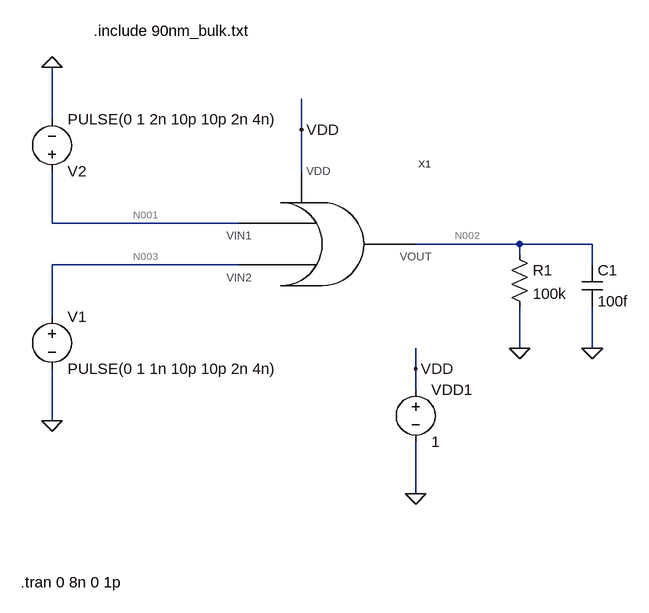
[diagram p0: schematic OR_tb.asc]
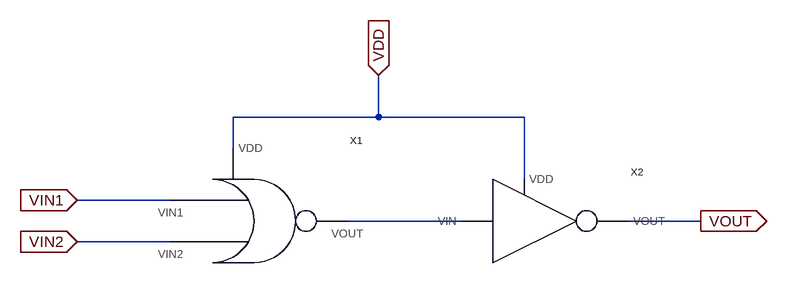
[diagram p1: sub-circuit or.asc]
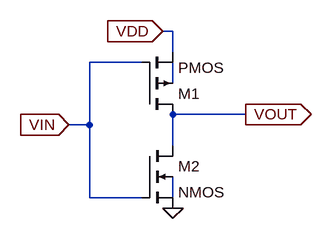
[diagram p2: sub-circuit not.asc]
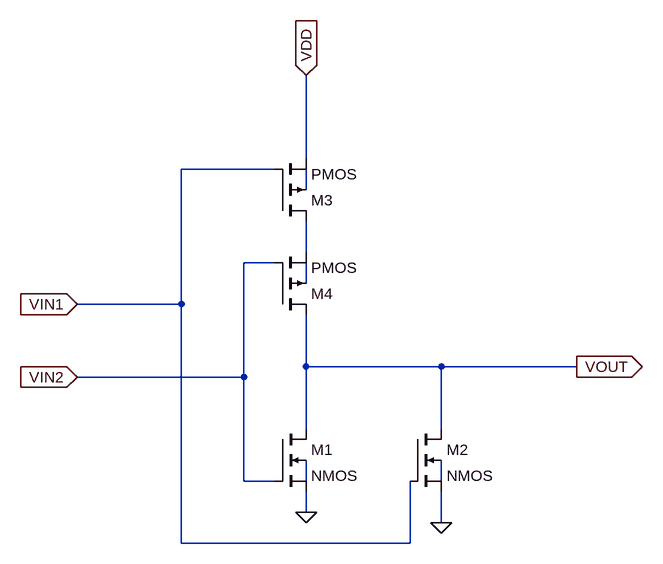
[diagram p3: sub-circuit nor.asc]
OR_tb.asc, the LTspice schematic file:
Version 4
SHEET 1 880 680
WIRE -416 -272 -416 -352
WIRE -32 -256 -32 -304
WIRE -32 -192 -32 -256
WIRE -416 -112 -416 -192
WIRE -128 -112 -416 -112
WIRE 304 -80 144 -80
WIRE 416 -80 304 -80
WIRE 304 -64 304 -80
WIRE -128 -48 -416 -48
WIRE 416 -48 416 -80
WIRE -416 32 -416 -48
WIRE 304 80 304 16
WIRE 416 80 416 16
WIRE 144 112 144 80
WIRE 144 144 144 112
WIRE -416 192 -416 112
WIRE 144 304 144 224
FLAG 144 304 0
FLAG 144 112 VDD
FLAG 304 80 0
FLAG 416 80 0
FLAG -32 -256 VDD
FLAG -416 192 0
FLAG -416 -352 0
SYMBOL voltage -416 16 R0
WINDOW 123 0 0 Left 0
WINDOW 39 0 0 Left 0
SYMATTR InstName V1
SYMATTR Value PULSE(0 1 1n 10p 10p 2n 4n)
SYMBOL res 288 -80 R0
SYMATTR InstName R1
SYMATTR Value 100k
SYMBOL cap 400 -48 R0
SYMATTR InstName C1
SYMATTR Value 100f
SYMBOL voltage 144 128 R0
WINDOW 123 0 0 Left 0
WINDOW 39 0 0 Left 0
SYMATTR InstName VDD1
SYMATTR Value 1
SYMBOL voltage -416 -176 M180
WINDOW 123 0 0 Left 0
WINDOW 39 0 0 Left 0
SYMATTR InstName V2
SYMATTR Value PULSE(0 1 2n 10p 10p 2n 4n)
SYMBOL OR -16 -80 R0
SYMATTR InstName X1
TEXT -352 -408 Left 2 !.include 90nm_bulk.txt
TEXT -464 440 Left 2 !.tran 0 8n 0 1p

or.asc, the sub-circuit schematic file:
Version 4
SHEET 1 972 680
WIRE 352 32 352 -32
WIRE 352 32 128 32
WIRE 576 32 352 32
WIRE 128 80 128 32
WIRE 576 128 576 32
WIRE 32 160 -112 160
WIRE 480 192 304 192
WIRE 848 192 736 192
WIRE 32 224 -112 224
FLAG -112 160 VIN1
IOPIN -112 160 In
FLAG -112 224 VIN2
IOPIN -112 224 In
FLAG 352 -32 VDD
IOPIN 352 -32 In
FLAG 848 192 VOUT
IOPIN 848 192 Out
SYMBOL NOT 576 192 R0
SYMATTR InstName X2
SYMBOL NOR 144 192 R0
SYMATTR InstName X1

not.asc, the sub-circuit schematic file:
Version 4
SHEET 1 880 680
WIRE 208 16 192 16
WIRE 208 48 208 16
WIRE 160 64 80 64
WIRE 208 96 208 64
WIRE 320 144 208 144
WIRE 80 160 80 64
WIRE 80 160 48 160
WIRE 208 192 208 144
WIRE 80 272 80 160
WIRE 160 272 80 272
WIRE 208 272 208 240
FLAG 48 160 VIN
IOPIN 48 160 In
FLAG 320 144 VOUT
IOPIN 320 144 Out
FLAG 192 16 VDD
IOPIN 192 16 In
FLAG 208 288 0
SYMBOL pmos4 160 144 M180
SYMATTR InstName M1
SYMATTR Value2 l=90n w=400n
SYMBOL nmos4 160 192 R0
SYMATTR InstName M2
SYMATTR Value2 l=90n w=200n

nor.asc, the sub-circuit schematic file:
Version 4
SHEET 1 992 680
WIRE 352 -64 352 -192
WIRE 304 -48 160 -48
WIRE 352 -16 352 -48
WIRE 352 80 352 32
WIRE 304 96 256 96
WIRE 352 128 352 96
WIRE 160 160 160 -48
WIRE 160 160 0 160
WIRE 352 256 352 176
WIRE 560 256 352 256
WIRE 768 256 560 256
WIRE 256 272 256 96
WIRE 256 272 0 272
WIRE 352 352 352 256
WIRE 560 352 560 256
WIRE 256 432 256 272
WIRE 304 432 256 432
WIRE 352 432 352 400
WIRE 560 432 560 400
WIRE 352 480 352 448
WIRE 560 496 560 448
WIRE 160 528 160 160
WIRE 512 528 512 432
WIRE 512 528 160 528
FLAG 352 480 0
FLAG 560 496 0
FLAG 0 160 VIN1
IOPIN 0 160 In
FLAG 0 272 VIN2
IOPIN 0 272 In
FLAG 352 -192 VDD
IOPIN 352 -192 In
FLAG 768 256 VOUT
IOPIN 768 256 Out
SYMBOL nmos4 304 352 R0
SYMATTR InstName M1
SYMATTR Value2 l=90n w=200n
SYMBOL nmos4 512 352 R0
SYMATTR InstName M2
SYMATTR Value2 l=90n w=200n
SYMBOL pmos4 304 32 M180
SYMATTR InstName M3
SYMATTR Value2 l=90n w=400n
SYMBOL pmos4 304 176 M180
SYMATTR InstName M4
SYMATTR Value2 l=90n w=400n

The netlist it stands for:
* OR_tb.asc
V1 N003 0 PULSE(0 1 1n 10p 10p 2n 4n)
R1 N002 0 100k
C1 N002 0 100f
VDD1 VDD 0 1
V2 N001 0 PULSE(0 1 2n 10p 10p 2n 4n)
XX1 VDD N001 N002 N003 or

* block symbol definitions
.subckt or VDD VIN1 VOUT VIN2
XX2 N001 VOUT VDD not
XX1 VDD VIN1 N001 VIN2 nor
.ends or

.subckt not VIN VOUT VDD
M1 VOUT VIN VDD N001 PMOS l=90n w=400n
M2 VOUT VIN 0 N002 NMOS l=90n w=200n
.ends not

.subckt nor VDD VIN1 VOUT VIN2
M1 VOUT VIN2 0 N004 NMOS l=90n w=200n
M2 VOUT VIN1 0 N005 NMOS l=90n w=200n
M3 N002 VIN1 VDD N001 PMOS l=90n w=400n
M4 VOUT VIN2 N002 N003 PMOS l=90n w=400n
.ends nor

.model NMOS NMOS
.model PMOS PMOS
.lib standard.mos
.include 90nm_bulk.txt
.tran 0 8n 0 1p
.backanno
.end

* Results of the author's LTspice run, read from the files saved beside the schematic
* Operating Point, zero values left out:
*   V(n002) = 56 µV
*   V(vdd) = 1 V
*   I(R1) = 560 pA
*   I(V2) = 130.7 pA
*   I(Vdd1) = -95.9 nA
*   I(V1) = 130.7 pA
*   Ix(x1:VDD) = 95.9 nA
*   Ix(x1:VIN1) = -130.7 pA
*   Ix(x1:VOUT) = -560 pA
*   Ix(x1:VIN2) = -130.7 pA
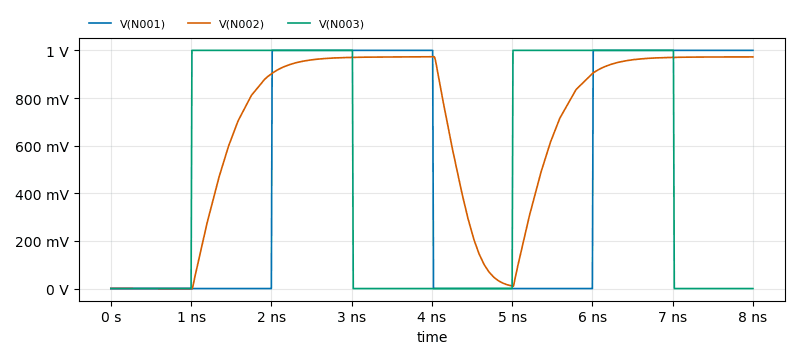
[diagram p4: Transient Analysis of OR_tb.asc, plotted from the saved traces]
* Transient Analysis, 1 run:
*   V(N001): min 0 V, max 1 V, average 500.6 mV, rms 707.1 mV, last 1 V
*   V(N002): min -1.084 mV, max 973.6 mV, average 664.8 mV, rms 767.6 mV, last 972.5 mV
*   V(N003): min 0 V, max 1 V, average 502.5 mV, rms 708.3 mV, last 0 V